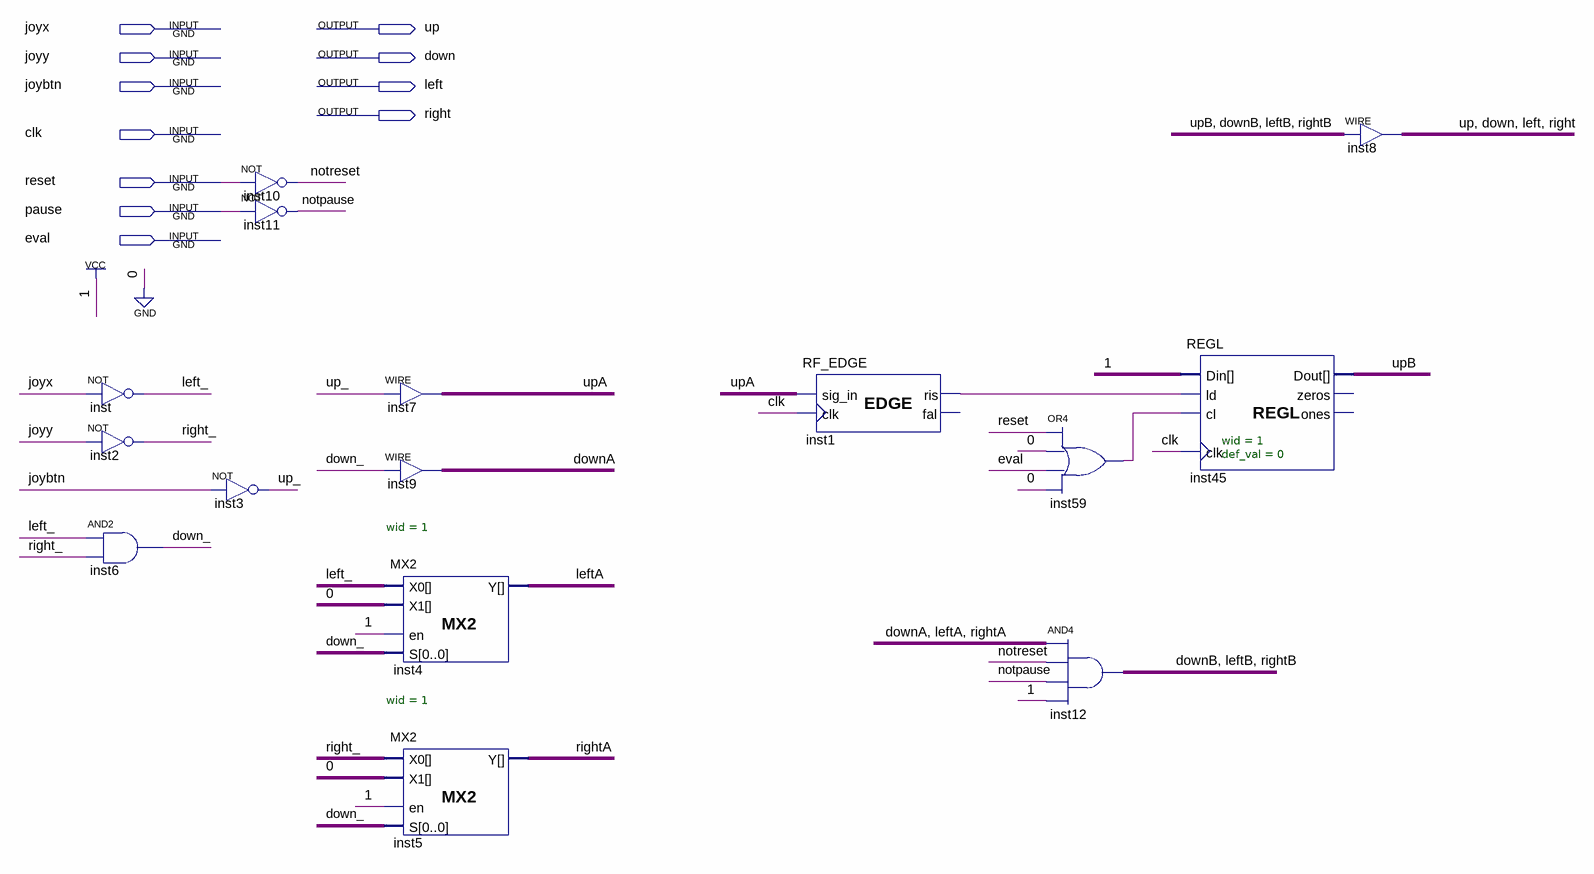
[diagram p0: schematic sheet]
// Quartus schematic dzojstik.bdf as structural Verilog: 15 symbols, 11 pins
module dzojstik (
  input  joyx,
  input  joyy,
  input  joybtn,
  input  clk,
  input  reset,
  input  pause,
  input  eval,
  output up,
  output down,
  output left,
  output right
);

  wire down_, downA, downB, inst1_ris, inst59_out, left_, leftA, leftB, notpause, notreset, right_, rightA,
       rightB, up_, upA, upB;

  not inst (left_, joyx);
  not inst2 (right_, joyy);
  and inst6 (down_, left_, right_);
  not inst10 (notreset, reset);
  not inst11 (notpause, pause);
  not inst3 (up_, joybtn);
  assign upA = up_;  // WIRE inst7
  assign downA = down_;  // WIRE inst9
  MX2 #(.wid(1)) inst4 (.X0(left_), .X1(1'b0), .en(1'b1), .S(down_), .Y(leftA));
  MX2 #(.wid(1)) inst5 (.X0(right_), .X1(1'b0), .en(1'b1), .S(down_), .Y(rightA));
  RF_EDGE inst1 (.sig_in(upA), .clk(clk), .ris(inst1_ris));  // open: fal
  or inst59 (inst59_out, reset, 1'b0, eval, 1'b0);
  assign {downB, leftB, rightB} = {downA, leftA, rightA} & {3{notreset}} & {3{notpause}} & 3'b111;  // AND4 inst12, 3 bits wide
  REGL #(.wid(1), .def_val(0)) inst45 (
    .Din(1'b1), .ld(inst1_ris), .cl(inst59_out), .clk(clk), .Dout(upB));  // open: zeros, ones
  assign {up, down, left, right} = {upB, downB, leftB, rightB};  // WIRE inst8
endmodule
